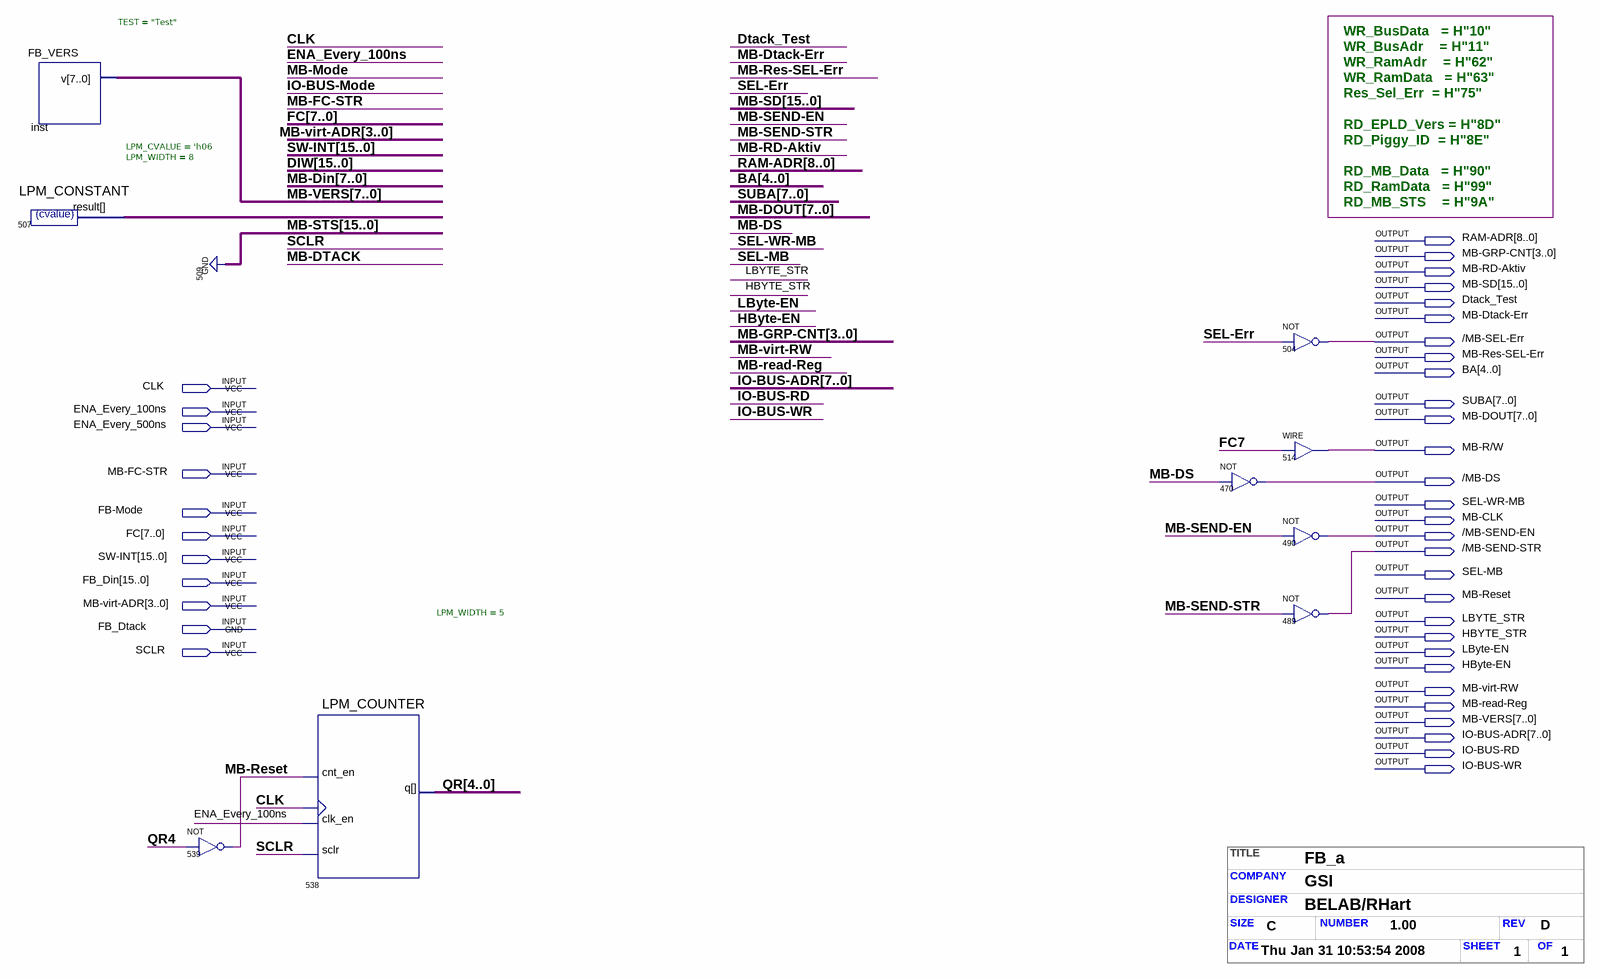
[diagram p0: schematic sheet]
// Quartus schematic fb_a.bdf as structural Verilog: 9 symbols, 40 pins
// Title block: TITLE: FB_a; COMPANY: GSI; DESIGNER: BELAB/RHart; SIZE: C; NUMBER: 1.00; REV: D; DATE: Thu Jan 31 10:53:54 2008; SHEET: 1; OF: 1
module fb_a (
  input  CLK,
  input  ENA_Every_100ns,
  input  ENA_Every_500ns,
  input  \MB-FC-STR ,
  input  \FB-Mode ,
  input  [7:0] FC,
  input  [15:0] \SW-INT ,
  input  [15:0] FB_Din,
  input  [3:0] \MB-virt-ADR ,
  input  FB_Dtack,
  input  SCLR,
  output [8:0] \RAM-ADR ,
  output [3:0] \MB-GRP-CNT ,
  output \MB-RD-Aktiv ,
  output [15:0] \MB-SD ,
  output Dtack_Test,
  output \MB-Dtack-Err ,
  output \/MB-SEL-Err ,
  output \MB-Res-SEL-Err ,
  output [4:0] BA,
  output [7:0] SUBA,
  output [7:0] \MB-DOUT ,
  output \MB-R/W ,
  output \/MB-DS ,
  output \SEL-WR-MB ,
  output \MB-CLK ,
  output \/MB-SEND-EN ,
  output \/MB-SEND-STR ,
  output \SEL-MB ,
  output \MB-Reset ,
  output LBYTE_STR,
  output HBYTE_STR,
  output \LByte-EN ,
  output \HByte-EN ,
  output \MB-virt-RW ,
  output \MB-read-Reg ,
  output [7:0] \MB-VERS ,
  output [7:0] \IO-BUS-ADR ,
  output \IO-BUS-RD ,
  output \IO-BUS-WR 
);

  wire \MB-DS , \MB-SEND-EN , \MB-SEND-STR , \SEL-Err ;
  wire [4:0] QR;
  wire [7:0] n507_result;

  FB_VERS #(.TEST("Test")) inst (.v(\MB-VERS ));
  LPM_CONSTANT #(.LPM_CVALUE('h06), .LPM_WIDTH(8)) u_507 (.result(n507_result));
  not u_539 (\MB-Reset , QR[4]);
  LPM_COUNTER #(.LPM_WIDTH(5)) u_538 (.cnt_en(\MB-Reset ), .clock(CLK), .clk_en(ENA_Every_100ns), .sclr(SCLR), .q(QR));
  not u_470 (\/MB-DS , \MB-DS );
  not u_504 (\/MB-SEL-Err , \SEL-Err );
  assign \MB-R/W  = FC[7];  // WIRE 514
  not u_490 (\/MB-SEND-EN , \MB-SEND-EN );
  not u_489 (\/MB-SEND-STR , \MB-SEND-STR );

  // Notes on the sheet:
  //   WR_BusData   = H"10"
  //   WR_BusAdr    = H"11"
  //   WR_RamAdr    = H"62"
  //   WR_RamData   = H"63"
  //   Res_Sel_Err  = H"75"
  //   RD_EPLD_Vers = H"8D"
  //   RD_Piggy_ID  = H"8E"
  //   RD_MB_Data   = H"90"
  //   RD_RamData   = H"99"
  //   RD_MB_STS    = H"9A"
endmodule
